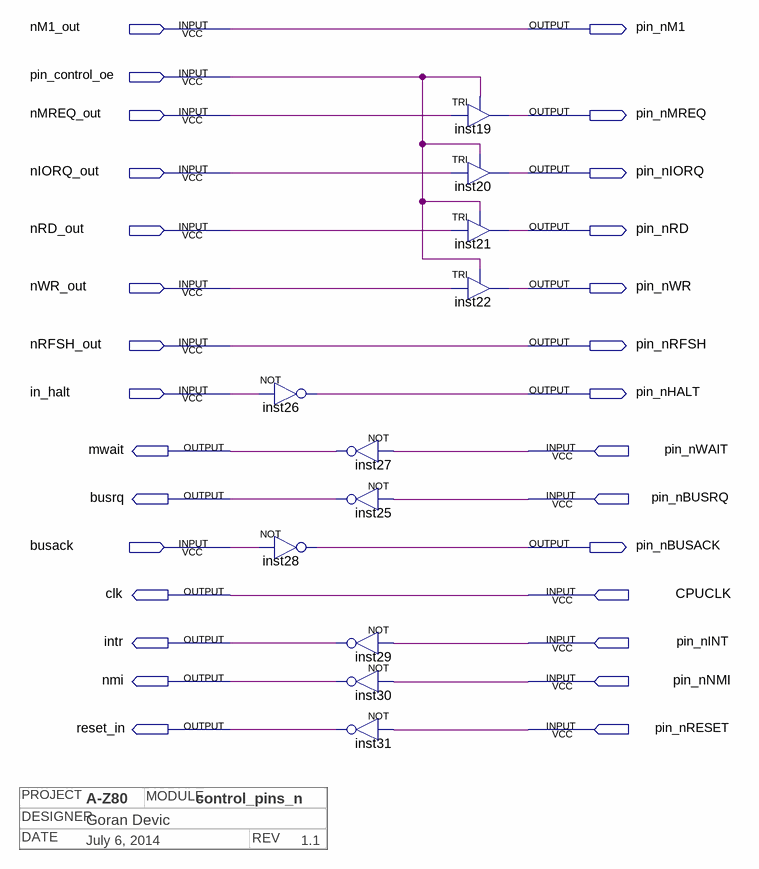
[diagram p0: schematic sheet]
// Quartus schematic control_pins_n.bdf as structural Verilog: 11 symbols, 29 pins
// Title block: PROJECT: A-Z80; MODULE: control_pins_n; DESIGNER: Goran Devic; DATE: July 6, 2014; REV: 1.1
module control_pins_n (
  input  nM1_out,
  input  pin_control_oe,
  input  nMREQ_out,
  input  nIORQ_out,
  input  nRD_out,
  input  nWR_out,
  input  nRFSH_out,
  input  in_halt,
  input  pin_nWAIT,
  input  pin_nBUSRQ,
  input  busack,
  input  CPUCLK,
  input  pin_nINT,
  input  pin_nNMI,
  input  pin_nRESET,
  output pin_nM1,
  output pin_nMREQ,
  output pin_nIORQ,
  output pin_nRD,
  output pin_nWR,
  output pin_nRFSH,
  output pin_nHALT,
  output mwait,
  output busrq,
  output pin_nBUSACK,
  output clk,
  output intr,
  output nmi,
  output reset_in
);

  not inst26 (pin_nHALT, in_halt);
  not inst28 (pin_nBUSACK, busack);
  not inst27 (mwait, pin_nWAIT);
  not inst25 (busrq, pin_nBUSRQ);
  not inst29 (intr, pin_nINT);
  not inst30 (nmi, pin_nNMI);
  not inst31 (reset_in, pin_nRESET);
  TRI inst19 (.IN(nMREQ_out), .OE(pin_control_oe), .OUT(pin_nMREQ));
  TRI inst20 (.IN(nIORQ_out), .OE(pin_control_oe), .OUT(pin_nIORQ));
  TRI inst21 (.IN(nRD_out), .OE(pin_control_oe), .OUT(pin_nRD));
  TRI inst22 (.IN(nWR_out), .OE(pin_control_oe), .OUT(pin_nWR));

  assign clk = CPUCLK;
  assign pin_nM1 = nM1_out;
  assign pin_nRFSH = nRFSH_out;
endmodule
